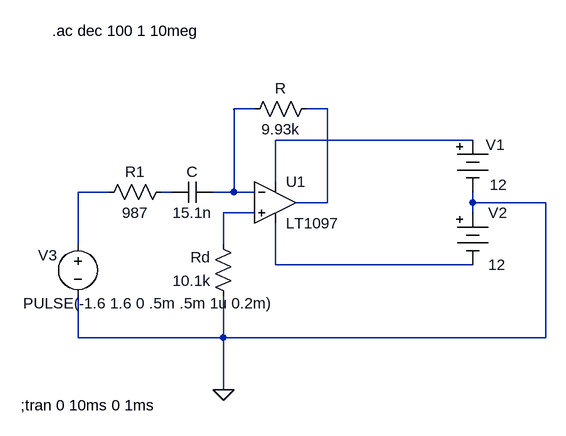
[diagram p0: schematic lab2Scheme.asc]
lab2Scheme.asc, the LTspice schematic file:
Version 4
SHEET 1 880 680
WIRE -176 -2992 -208 -2992
WIRE -64 -2992 -96 -2992
WIRE 160 -2944 -144 -2944
WIRE -144 -2880 -144 -2944
WIRE -400 -2864 -448 -2864
WIRE -304 -2864 -320 -2864
WIRE -208 -2864 -208 -2992
WIRE -208 -2864 -240 -2864
WIRE -176 -2864 -208 -2864
WIRE -64 -2848 -64 -2992
WIRE -64 -2848 -112 -2848
WIRE 160 -2848 160 -2864
WIRE 272 -2848 160 -2848
WIRE -176 -2832 -224 -2832
WIRE 160 -2832 160 -2848
WIRE -448 -2784 -448 -2864
WIRE -224 -2784 -224 -2832
WIRE -144 -2752 -144 -2816
WIRE 160 -2752 -144 -2752
WIRE -448 -2640 -448 -2704
WIRE -224 -2640 -224 -2704
WIRE -224 -2640 -448 -2640
WIRE 272 -2640 272 -2848
WIRE 272 -2640 -224 -2640
WIRE -224 -2560 -224 -2640
FLAG -224 -2560 0
SYMBOL OpAmps\\LT1097 -144 -2912 R0
SYMATTR InstName U1
SYMBOL res -80 -3008 R90
WINDOW 0 0 56 VBottom 2
WINDOW 3 32 56 VTop 2
SYMATTR InstName R
SYMATTR Value 9.93k
SYMBOL res -208 -2688 R180
WINDOW 0 36 76 Left 2
WINDOW 3 35 40 Left 2
SYMATTR InstName Rd
SYMATTR Value 10.1k
SYMBOL Misc\\battery 160 -2960 R0
WINDOW 123 0 0 Left 0
WINDOW 39 0 0 Left 0
WINDOW 0 20 23 Left 2
WINDOW 3 26 85 Left 2
SYMATTR InstName V1
SYMATTR Value 12
SYMBOL voltage -448 -2800 R0
WINDOW 3 -84 107 Left 2
WINDOW 39 0 0 Left 0
WINDOW 0 -61 33 Left 2
SYMATTR Value PULSE(-1.6 1.6 0 .5m .5m 1u 0.2m)
SYMATTR InstName V3
SYMATTR Value2 AC 25m
SYMBOL Misc\\battery 160 -2848 R0
WINDOW 123 0 0 Left 0
WINDOW 39 0 0 Left 0
SYMATTR InstName V2
SYMATTR Value 12
SYMBOL cap -240 -2880 R90
WINDOW 0 0 32 VBottom 2
WINDOW 3 32 32 VTop 2
SYMATTR InstName C
SYMATTR Value 15.1n
SYMBOL res -304 -2880 R90
WINDOW 0 0 56 VBottom 2
WINDOW 3 32 56 VTop 2
SYMATTR InstName R1
SYMATTR Value 987
TEXT -536 -2536 Left 2 !;tran 0 10ms 0 1ms
TEXT -488 -3112 Left 2 !.ac dec 100 1 10meg

The netlist it stands for:
* lab2Scheme.asc
XU1 N006 N001 N003 N007 N002 LT1097  ; pins In+ In- V+ V- OUT
R N002 N001 9.93k
Rd 0 N006 10.1k
V1 N003 0 12
V3 N004 0 PULSE(-1.6 1.6 0 .5m .5m 1u 0.2m) AC 25m
V2 0 N007 12
C N001 N005 15.1n
R1 N005 N004 987
;tran 0 10ms 0 1ms
.ac dec 100 1 10meg
.backanno
.end